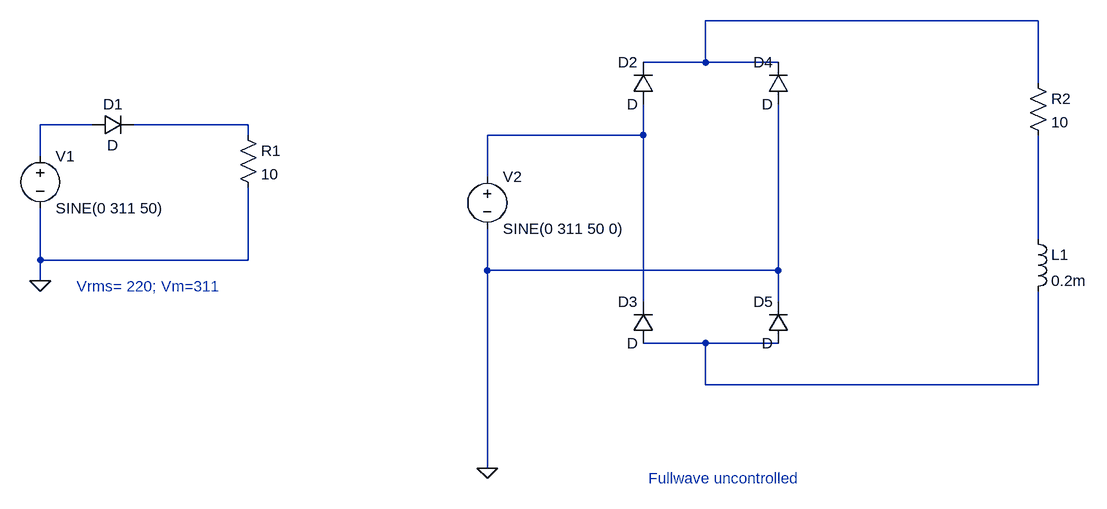
[diagram p0: schematic halfwave_uncontrolled.asc]
halfwave_uncontrolled.asc, the LTspice schematic file:
Version 4
SHEET 1 1584 680
WIRE 1504 -80 992 -80
WIRE 992 -16 992 -80
WIRE 992 -16 896 -16
WIRE 1104 -16 992 -16
WIRE 1504 16 1504 -80
WIRE 48 80 -32 80
WIRE 288 80 112 80
WIRE 288 96 288 80
WIRE 896 96 896 48
WIRE 896 96 656 96
WIRE -32 128 -32 80
WIRE 656 160 656 96
WIRE 1504 256 1504 96
WIRE -32 288 -32 208
WIRE 288 288 288 176
WIRE 288 288 -32 288
WIRE 656 304 656 240
WIRE 1104 304 1104 48
WIRE 1104 304 656 304
WIRE -32 320 -32 288
WIRE 896 352 896 96
WIRE 1104 352 1104 304
WIRE 992 416 896 416
WIRE 1104 416 992 416
WIRE 992 480 992 416
WIRE 1504 480 1504 336
WIRE 1504 480 992 480
WIRE 656 608 656 304
FLAG -32 320 0
FLAG 656 608 0
SYMBOL voltage -32 112 R0
WINDOW 123 0 0 Left 0
WINDOW 39 0 0 Left 0
SYMATTR InstName V1
SYMATTR Value SINE(0 311 50)
SYMBOL diode 48 96 R270
WINDOW 0 32 32 VTop 2
WINDOW 3 0 32 VBottom 2
SYMATTR InstName D1
SYMBOL res 272 80 R0
SYMATTR InstName R1
SYMATTR Value 10
SYMBOL voltage 656 144 R0
WINDOW 123 0 0 Left 0
WINDOW 39 0 0 Left 0
SYMATTR InstName V2
SYMATTR Value SINE(0 311 50 0)
SYMBOL diode 912 48 R180
WINDOW 0 24 64 Left 2
WINDOW 3 24 0 Left 2
SYMATTR InstName D2
SYMBOL diode 912 416 R180
WINDOW 0 24 64 Left 2
WINDOW 3 24 0 Left 2
SYMATTR InstName D3
SYMBOL diode 1120 48 R180
WINDOW 0 24 64 Left 2
WINDOW 3 24 0 Left 2
SYMATTR InstName D4
SYMBOL diode 1120 416 R180
WINDOW 0 24 64 Left 2
WINDOW 3 24 0 Left 2
SYMATTR InstName D5
SYMBOL res 1488 0 R0
SYMATTR InstName R2
SYMATTR Value 10
SYMBOL ind 1488 240 R0
SYMATTR InstName L1
SYMATTR Value 0.2m
TEXT 24 328 Left 2 ;Vrms= 220; Vm=311
TEXT 904 624 Left 2 ;Fullwave uncontrolled

The netlist it stands for:
* halfwave_uncontrolled.asc
V1 N002 0 SINE(0 311 50)
D1 N002 N003 D
R1 N003 0 10
V2 N004 0 SINE(0 311 50 0)
D2 N004 N001 D
D3 N006 N004 D
D4 0 N001 D
D5 N006 0 D
R2 N001 N005 10
L1 N005 N006 0.2m
.model D D
.lib standard.dio
* Vrms= 220; Vm=311
* Fullwave uncontrolled
.backanno
.end